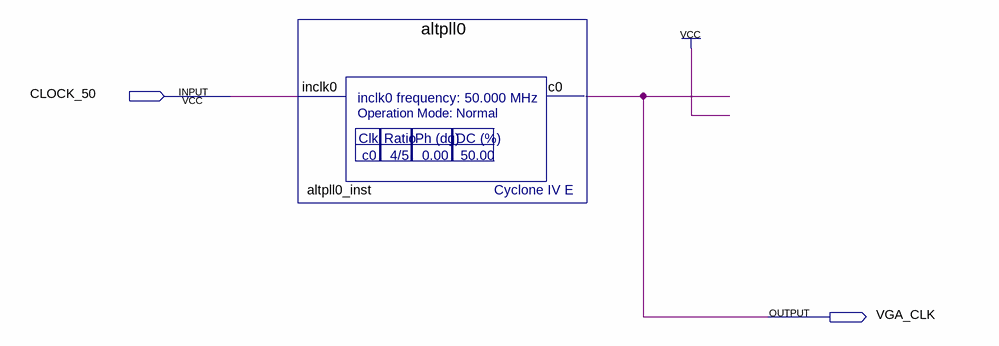
[diagram p0: schematic sheet]
// Quartus schematic ColourFiltering.bdf as structural Verilog: 1 symbols, 2 pins
module ColourFiltering (
  input  CLOCK_50,
  output VGA_CLK
);

  altpll0 altpll0_inst (.inclk0(CLOCK_50), .c0(VGA_CLK));
endmodule
